# EAGLE schematic clock_prototype (EAGLE 6.4)
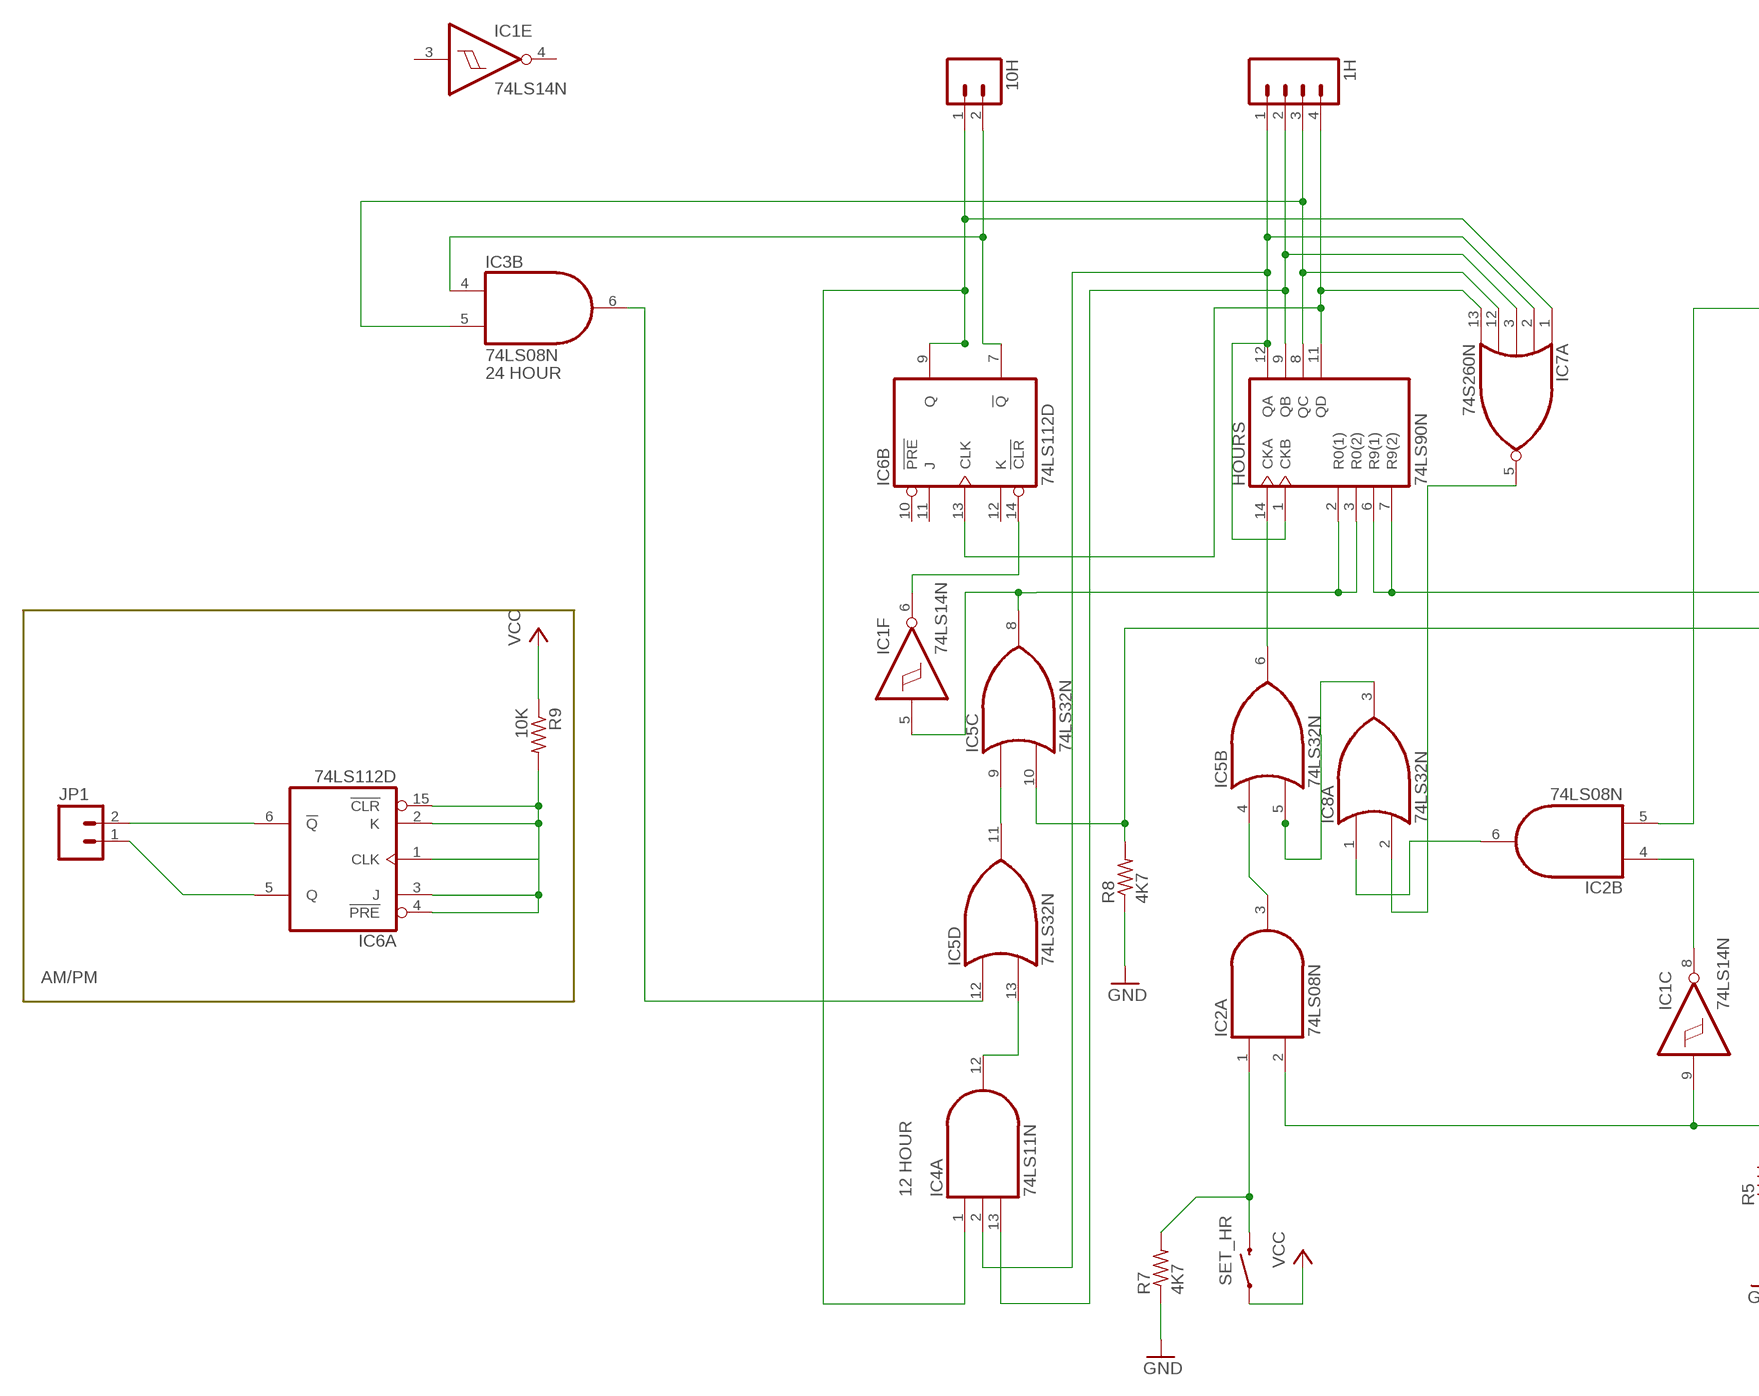
[diagram p0: schematic, sheet 1, part 1 of 2]
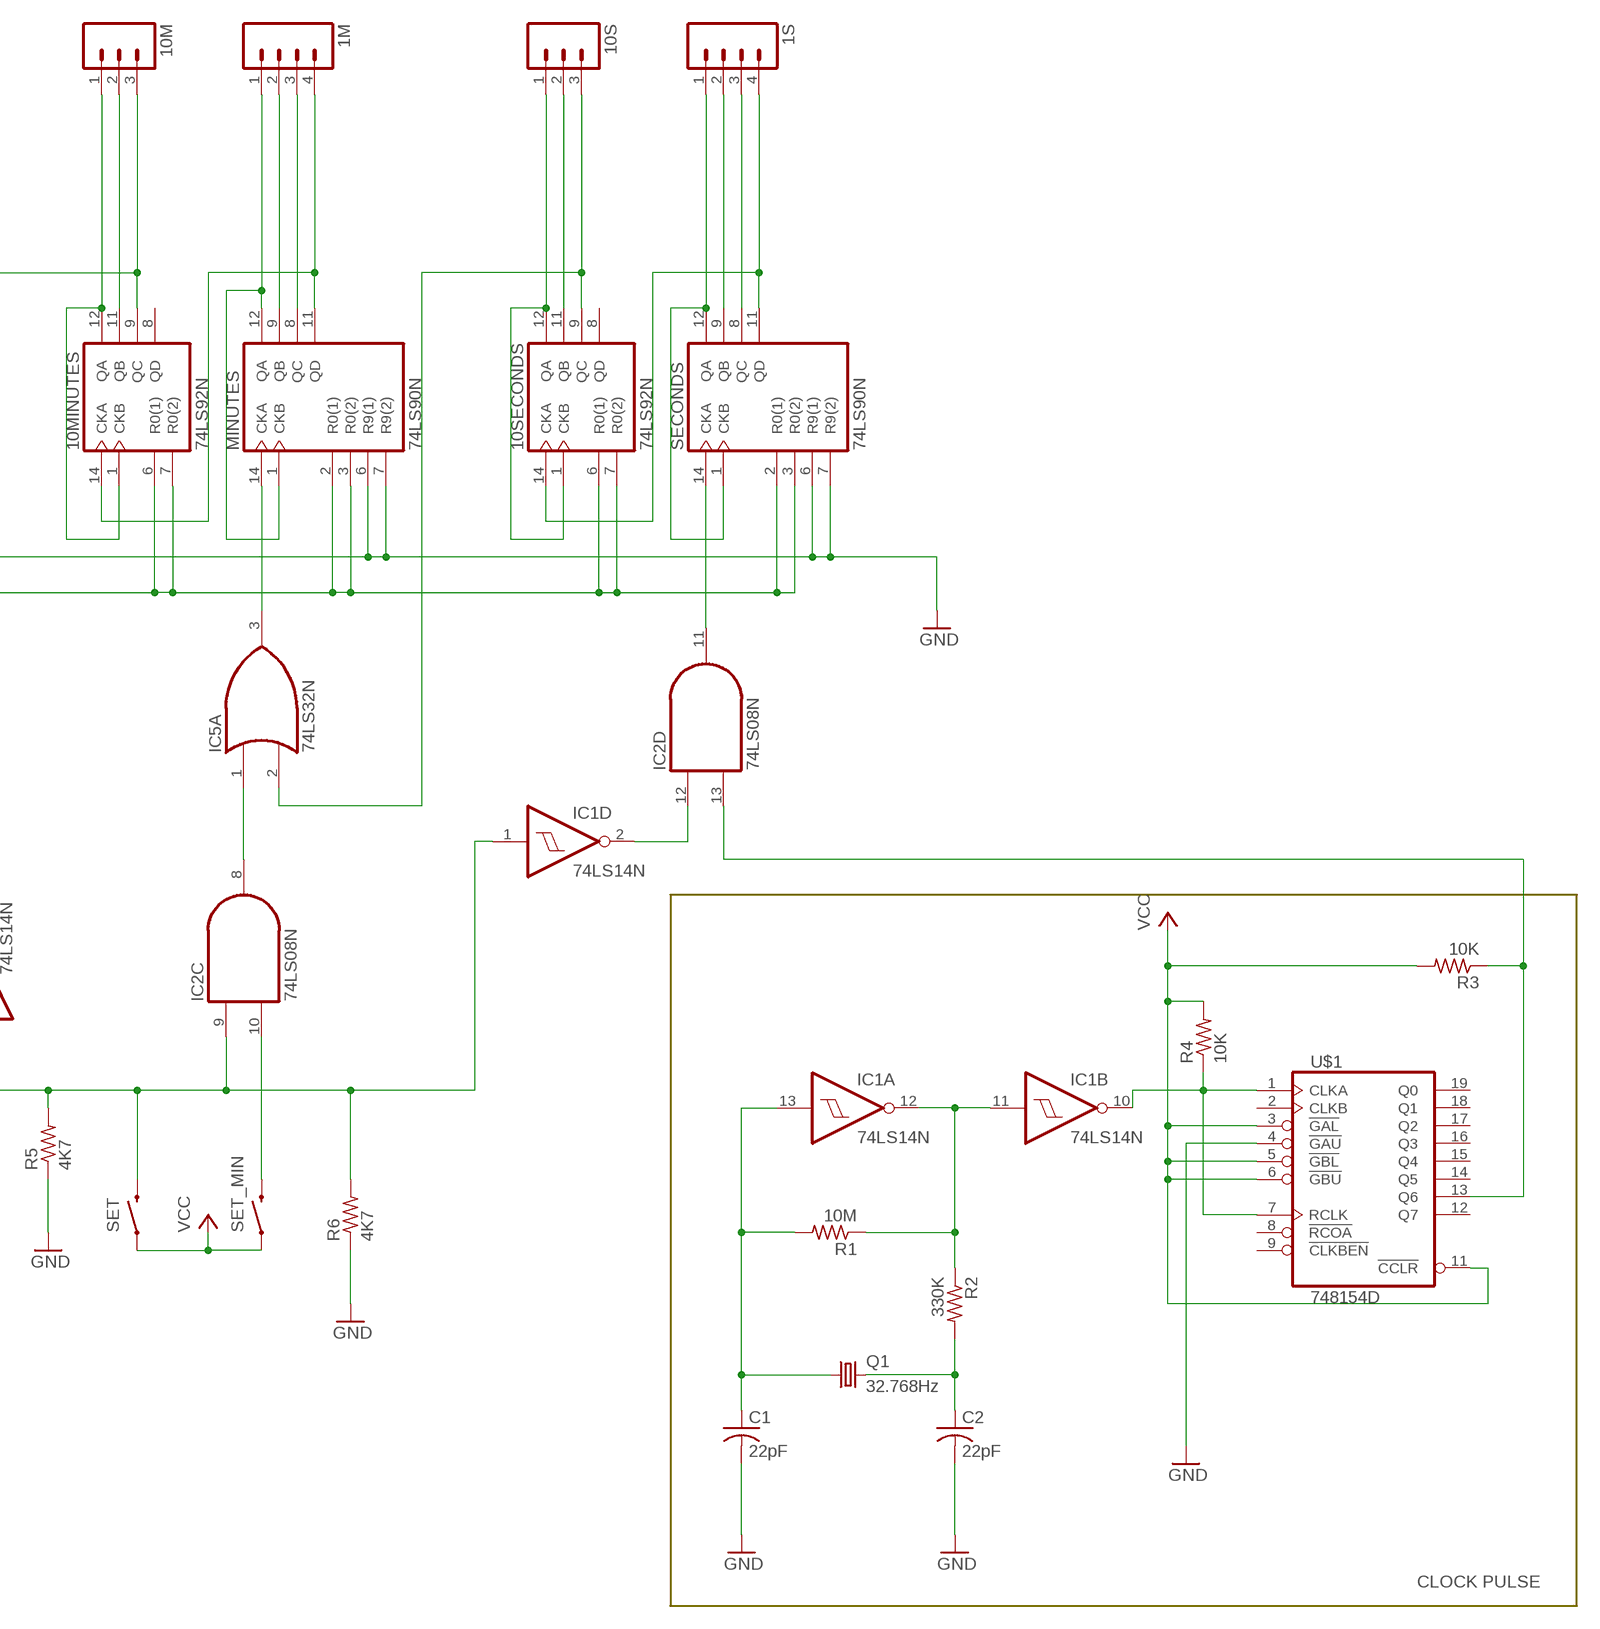
[diagram p1: schematic, sheet 1, part 2 of 2]

## Parts
1H  M04PTH  [1X04]
1M  M04PTH  [1X04]
1S  M04PTH  [1X04]
10H  M02PTH  [1X02]
10M  M03PTH  [1X03]
10MINUTES  74LS92N  [DIL14]
10S  M03PTH  [1X03]
10SECONDS  74LS92N  [DIL14]
C1  22pF  CAPACITOR050-024X044  [C050-024X044]
C2  22pF  CAPACITOR050-024X044  [C050-024X044]
HOURS  74LS90N  [DIL14]
IC1  74LS14N  [DIL14]
IC2  74LS08N  [DIL14]
IC3  74LS08N  [DIL14]
IC4  74LS11N  [DIL14]
IC5  74LS32N  [DIL14]
IC6  74LS112D  [SO16]
IC7  74S260N  [DIL14]
IC8  74LS32N  [DIL14]
JP1  M02PTH  [1X02]
MINUTES  74LS90N  [DIL14]
Q1  32.768Hz  CRYSTALTC26V  [TC26V]
R1  10M  RESISTOR0207/7  [0207/7]
R2  330K  RESISTOR0207/7  [0207/7]
R3  10K  RESISTOR0207/7  [0207/7]
R4  10K  RESISTOR0207/7  [0207/7]
R5  4K7  RESISTOR0207/7  [0207/7]
R6  4K7  RESISTOR0207/7  [0207/7]
R7  4K7  RESISTOR0207/7  [0207/7]
R8  4K7  RESISTOR0207/7  [0207/7]
R9  10K  RESISTOR0207/7  [0207/7]
SECONDS  74LS90N  [DIL14]
SET  SWITCH-MOMENTARY12MM  [TACTILE-PTH-12MM]
SET_HR  SWITCH-MOMENTARY12MM  [TACTILE-PTH-12MM]
SET_MIN  SWITCH-MOMENTARY12MM  [TACTILE-PTH-12MM]
U$1  748154D  [TSSOP20]

## Nets
1H_A: 1H.1 HOURS.1(CKB) HOURS.12(QA) IC4.2(A:I1) IC7.2(A:I1)
1H_B: 1H.2 HOURS.9(QB) IC4.13(A:I2) IC7.3(A:I2)
1H_C: 1H.3 HOURS.8(QC) IC3.5(B:I1) IC7.12(A:I3)
1H_D: 1H.4 HOURS.11(QD) IC6.13(B:CLK) IC7.13(A:I4)
1M_A: 1M.1 MINUTES.1(CKB) MINUTES.12(QA)
1M_B: 1M.2 MINUTES.9(QB)
1M_C: 1M.3 MINUTES.8(QC)
1M_D: 1M.4 10MINUTES.14(CKA) MINUTES.11(QD)
1S_A: 1S.1 SECONDS.1(CKB) SECONDS.12(QA)
1S_B: 1S.2 SECONDS.9(QB)
1S_C: 1S.3 SECONDS.8(QC)
1S_D: 1S.4 10SECONDS.14(CKA) SECONDS.11(QD)
10H_B: 10H.2 IC3.4(B:I0) IC6.7(B:!Q)
10M_A: 10M.1 10MINUTES.1(CKB) 10MINUTES.12(QA)
10M_B: 10M.2 10MINUTES.11(QB)
10M_C: 10M.3 10MINUTES.9(QC) IC2.5(B:I1)
10S_A: 10S.1 10SECONDS.1(CKB) 10SECONDS.12(QA)
10S_B: 10S.2 10SECONDS.11(QB)
10S_C: 10S.3 10SECONDS.9(QC) IC5.2(A:I1)
AM: IC6.5(A:Q) JP1.1
GND: C1.2 C2.2 HOURS.6(R9(1)) HOURS.7(R9(2)) MINUTES.6(R9(1)) MINUTES.7(R9(2)) R5.1 R6.1 R7.1 R8.1 SECONDS.6(R9(1)) SECONDS.7(R9(2)) U$1.4(!GAU)
N$1: IC5.3(A:O) MINUTES.14(CKA)
N$2: IC2.8(C:O) IC5.1(A:I0)
N$3: IC5.5(B:I1) IC8.3(A:O)
N$4: IC2.3(A:O) IC5.4(B:I0)
N$5: 10H.1 IC4.1(A:I0) IC6.9(B:Q) IC7.1(A:I0)
N$6: 10MINUTES.6(R0(1)) 10MINUTES.7(R0(2)) 10SECONDS.6(R0(1)) 10SECONDS.7(R0(2)) IC5.10(C:I1) MINUTES.2(R0(1)) MINUTES.3(R0(2)) R8.2 SECONDS.2(R0(1)) SECONDS.3(R0(2))
N$7: IC6.2(A:K) IC6.3(A:J) IC6.4(A:!PRE) IC6.15(A:!CLR) R9.2
N$8: IC1.6(F:O) IC6.14(B:!CLR)
N$9: IC5.9(C:I0) IC5.11(D:O)
N$10: IC4.12(A:O) IC5.13(D:I1)
N$11: C1.1 IC1.13(A:I) Q1.1 R1.2
N$12: C2.1 Q1.2 R2.2
N$13: IC1.11(B:I) IC1.12(A:O) R1.1 R2.1
N$14: IC1.10(B:O) R4.1 U$1.1(CLKA) U$1.7(RCLK)
N$15: IC2.11(D:O) SECONDS.14(CKA)
N$16: IC2.13(D:I1) R3.1 U$1.13(Q6)
N$17: IC1.2(D:O) IC2.12(D:I0)
N$18: IC1.1(D:I) IC1.9(C:I) IC2.2(A:I1) IC2.9(C:I0) R5.2 R6.2 SET.3 SET.4
N$19: IC2.10(C:I1) SET_MIN.3 SET_MIN.4
N$20: IC1.8(C:O) IC2.4(B:I0)
N$21: HOURS.14(CKA) IC5.6(B:O)
N$22: IC7.5(A:O) IC8.2(A:I1)
N$23: IC2.1(A:I0) R7.2 SET_HR.3 SET_HR.4
N$24: IC2.6(B:O) IC8.1(A:I0)
N$25: HOURS.2(R0(1)) HOURS.3(R0(2)) IC1.5(F:I) IC5.8(C:O)
N$27: IC6.1(A:CLK)
N$28: IC3.6(B:O) IC5.12(D:I0)
PM: IC6.6(A:!Q) JP1.2
VCC: R3.2 R4.2 R9.1 SET.1 SET.2 SET_HR.1 SET_HR.2 SET_MIN.1 SET_MIN.2 U$1.3(!GAL) U$1.5(!GBL) U$1.6(!GBU) U$1.11(!CCLR)
Unconnected: 10MINUTES.8(QD) 10SECONDS.8(QD) IC1.3(E:I) IC1.4(E:O) IC3.1(A:I0) IC3.2(A:I1) IC3.3(A:O) IC3.8(C:O) IC3.9(C:I0) IC3.10(C:I1) IC3.11(D:O) IC3.12(D:I0) IC3.13(D:I1) IC4.3(B:I0) IC4.4(B:I1) IC4.5(B:I2) IC4.6(B:O) IC4.8(C:O) IC4.9(C:I0) IC4.10(C:I1) IC4.11(C:I2) IC6.10(B:!PRE) IC6.11(B:J) IC6.12(B:K) IC7.4(B:I0) IC7.6(B:O) IC7.8(B:I1) IC7.9(B:I2) IC7.10(B:I3) IC7.11(B:I4) IC8.4(B:I0) IC8.5(B:I1) IC8.6(B:O) IC8.8(C:O) IC8.9(C:I0) IC8.10(C:I1) IC8.11(D:O) IC8.12(D:I0) IC8.13(D:I1) U$1.2(CLKB) U$1.8(!RCOA) U$1.9(!CLKBEN) U$1.12(Q7) U$1.14(Q5) U$1.15(Q4) U$1.16(Q3) U$1.17(Q2) U$1.18(Q1) U$1.19(Q0)

## Notes on the sheet
- 24 HOUR
- AM/PM
- 12 HOUR
- CLOCK PULSE

## Power pins joined to a net without a drawn wire
GND: 10MINUTES.10(GND) 10SECONDS.10(GND) HOURS.10(GND) IC1.7(P:GND) IC2.7(P:GND) IC3.7(P:GND) IC4.7(P:GND) IC5.7(P:GND) IC6.8(P:GND) IC7.7(P:GND) IC8.7(P:GND) MINUTES.10(GND) SECONDS.10(GND) U$1.10(GND)
VCC: 10MINUTES.5(VCC) 10SECONDS.5(VCC) HOURS.5(VCC) IC1.14(P:VCC) IC2.14(P:VCC) IC3.14(P:VCC) IC4.14(P:VCC) IC5.14(P:VCC) IC6.16(P:VCC) IC7.14(P:VCC) IC8.14(P:VCC) MINUTES.5(VCC) SECONDS.5(VCC) U$1.20(VCC)

## Library data of the parts
1H 1M 1S = iStivi - Header-Connector:M04: Header 4 Standard 4-pin 0.1" header. Use with straight break away headers (SKU : PRT-00116), right angle break away headers (PRT-00553), swiss pins (PRT-00743), machine pins (PRT-00117), and female headers (PRT-00115). Molex polarized connector foot print use with SKU : PRT-08231 with associated crimp pins and housings. 1MM SMD Version SKU: PRT-10208
10H JP1 = iStivi - Header-Connector:M02: Header 2 Standard 2-pin 0.1" header. Use with straight break away headers (SKU : PRT-00116), right angle break away headers (PRT-00553), swiss pins (PRT-00743), machine pins (PRT-00117), and female headers (PRT-00115). Molex polarized connector foot print use with SKU : PRT-08233 with associated crimp pins and housings.
10M 10S = iStivi - Header-Connector:M03: Header 3 Standard 3-pin 0.1" header. Use with straight break away headers (SKU : PRT-00116), right angle break away headers (PRT-00553), swiss pins (PRT-00743), machine pins (PRT-00117), and female headers (PRT-00115). Molex polarized connector foot print use with SKU : PRT-08232 with associated crimp pins and housings.
10MINUTES 10SECONDS = iStivi - ICs:74*92: Divide by 12 counter
C1 C2 = iStivi - RCLD:CAPACITOR: CAPACITOR, American symbol
HOURS MINUTES SECONDS = iStivi - ICs:74*90: Decade Counter BCD decade counter
IC1 = iStivi - ICs:74*14: Hex schmitt trigger INVERTER
IC2 IC3 = iStivi - ICs:74*08: Quad 2-input AND gate
IC4 = iStivi - ICs:74*11: Triple 3-input AND gate
IC5 IC8 = iStivi - ICs:74*32: Quad 2-input OR gate
IC6 = iStivi - ICs:74*112: Dual J-K negative edge triggered FLIP FLOP, preset and clear
IC7 = iStivi - ICs:74*260: Dual 5-input positive NOR gate
Q1 = iStivi - Oscillators:CRYSTAL: CRYSTAL; OC_FARNELL: unknown; OC_NEWARK: unknown
R1-R9 = iStivi - RCLD:RESISTOR: RESISTOR
SET SET_HR SET_MIN = iStivi - Button-Switch:SWITCH-MOMENTARY: Momentary Switch
U$1 = iStivi - ICs:74*8154: 16-bit binary counter Dual 16-bit binary counter with 3-state output register